# EasyEDA schematic Kyocera breakout board.json
TITLE: Sheet_1; REV: 1.0; Date: 2023-03-23; Sheet: 1/1; Drawn By: carlosvidal; Company: Your Company
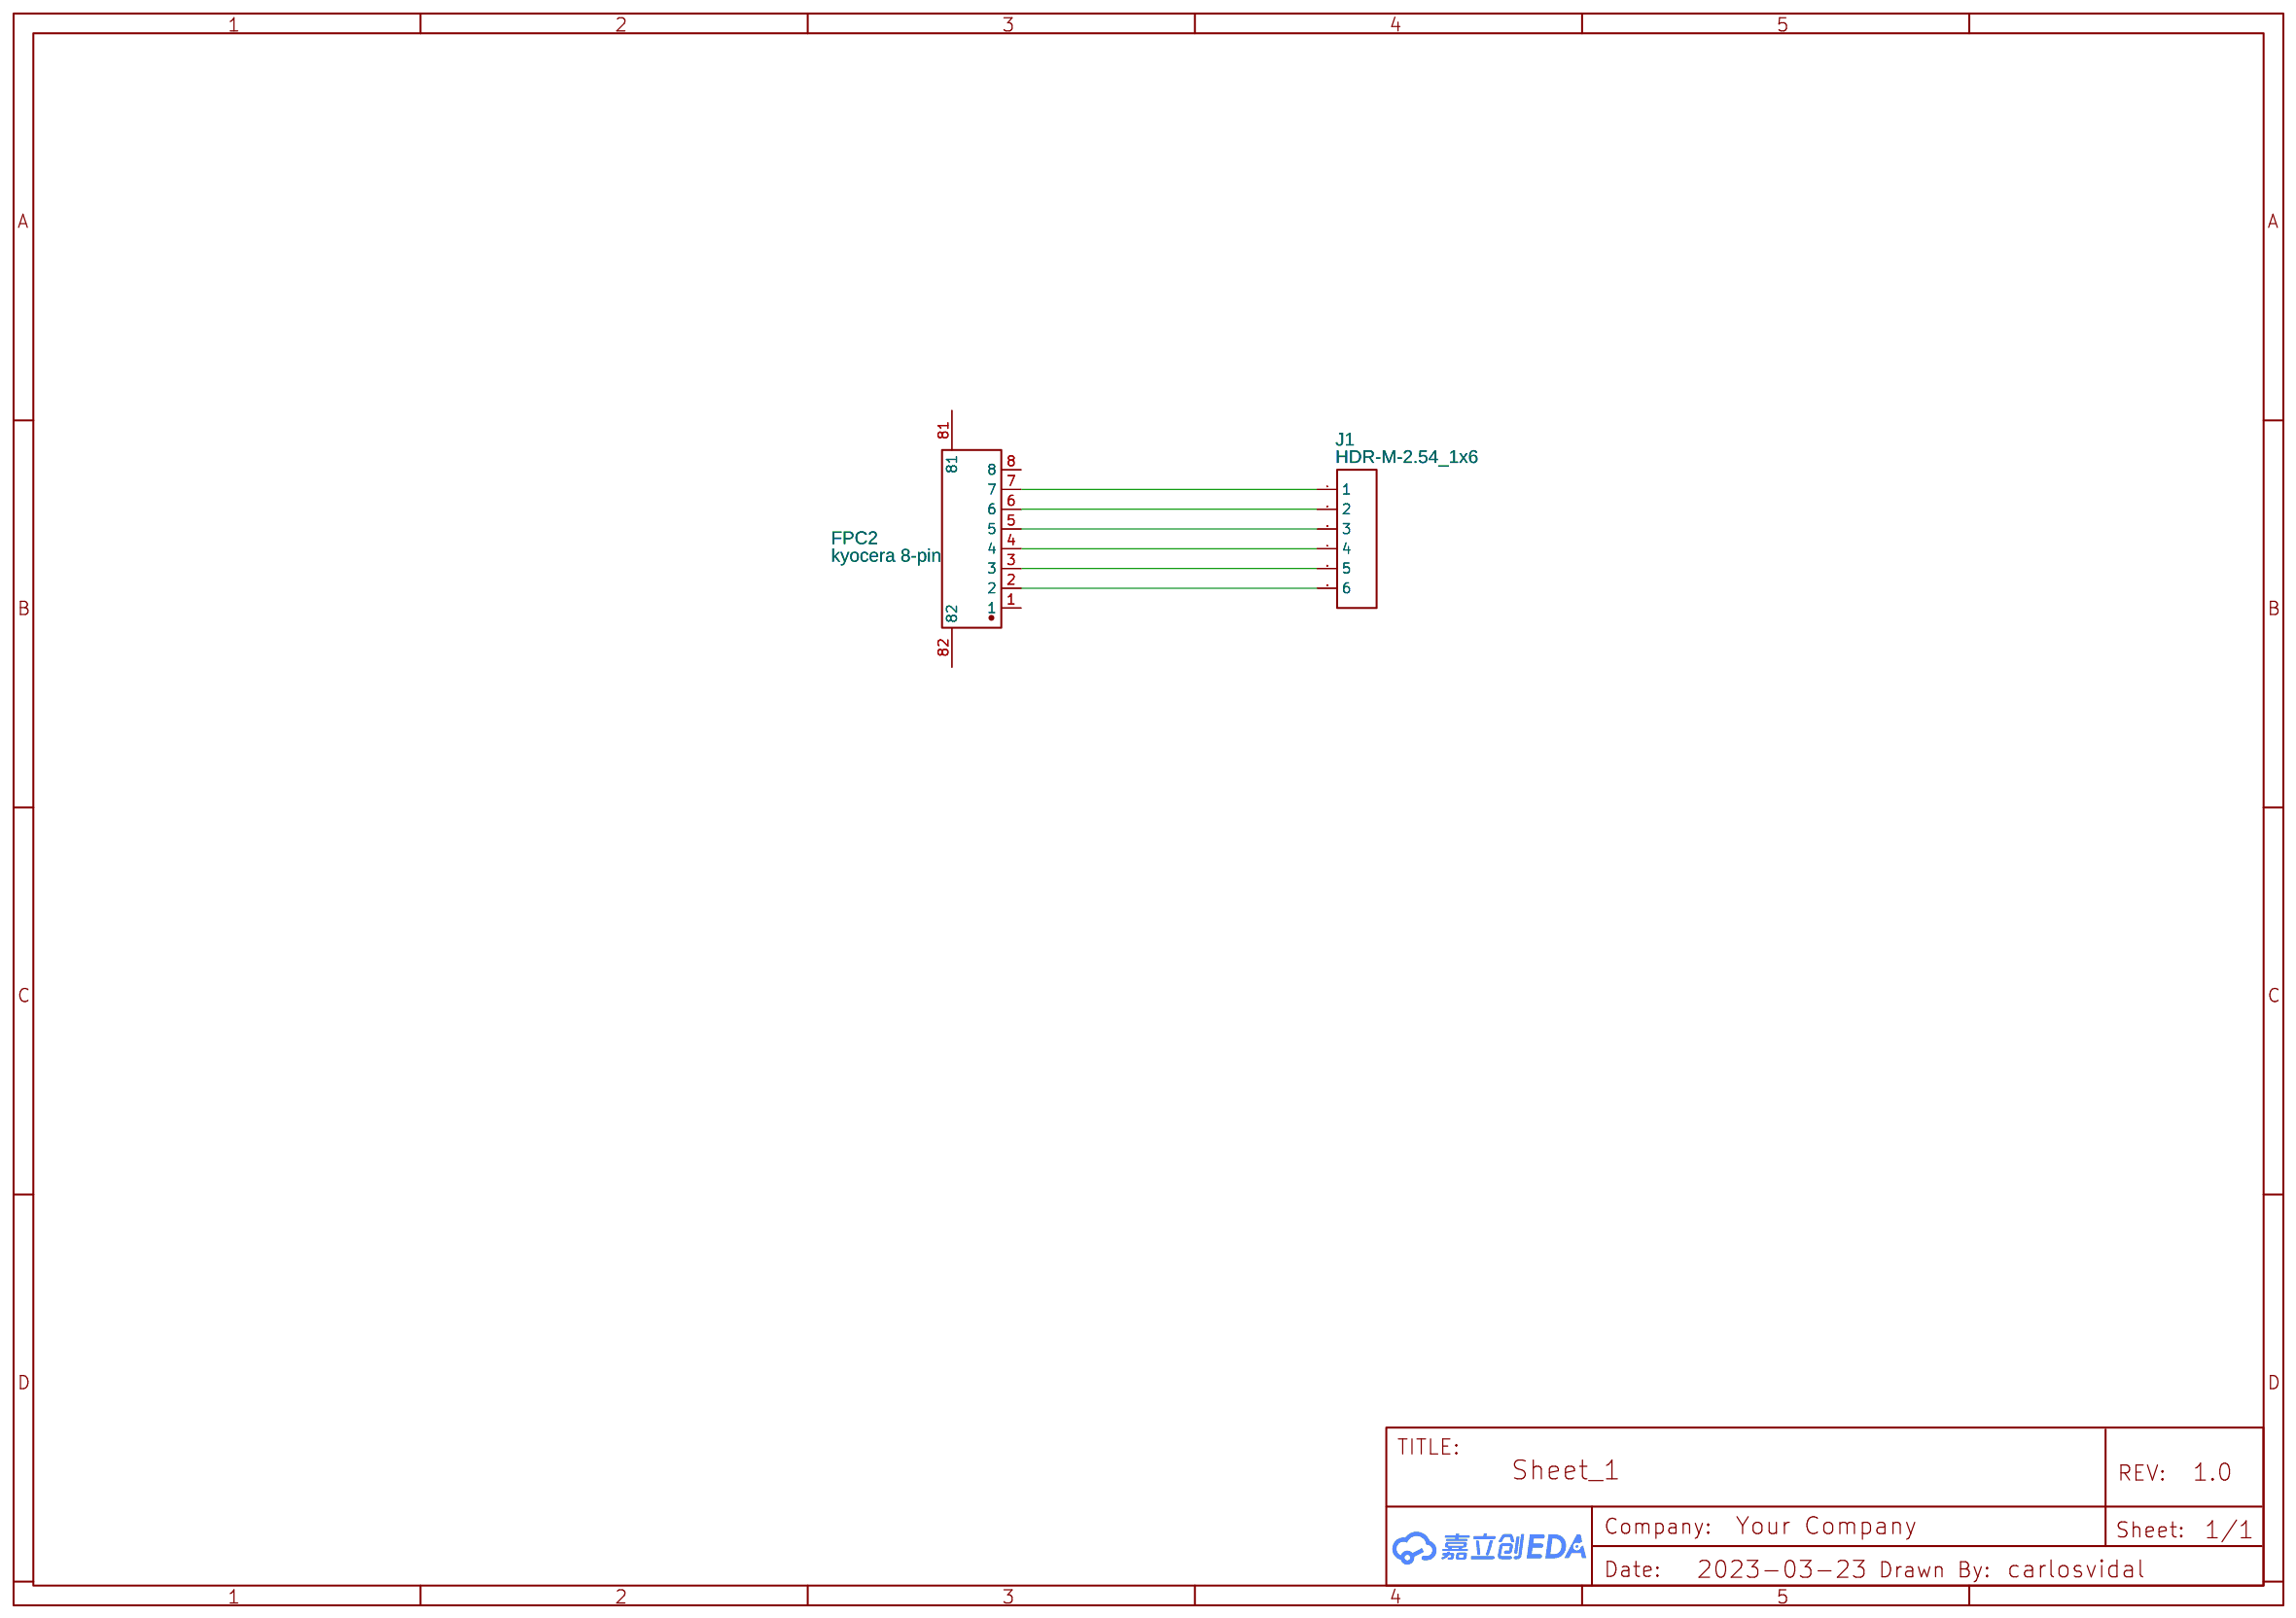
[diagram p0: schematic sheet]

## Parts
FPC2  kyocera 8-pin  [FPC-SMD_046288080000846]
J1  HDR-M-2.54_1x6  [HDR-M-2.54_1X6]

## Library data of the parts
FPC2 = kyocera 8-pin: Supplier: Digi-Key; Supplier Part: C513346; Manufacturer: Kyocera AVX; Manufacturer Part: 046288080000846+; Contributor: carlosvidal; JLCPCB Part Class: Extended Part; link: https://www.digikey.se/en/products/detail/kyocera-avx/046288008000846/2000996
J1 = HDR-M-2.54_1x6: Supplier Part: C190819; Supplier: LCSC; Contributor: LCEDA_Lib

## Nets
Net-(FPC2-2): FPC2.2 J1.6
Net-(FPC2-3): FPC2.3 J1.5
Net-(FPC2-4): FPC2.4 J1.4
Net-(FPC2-5): FPC2.5 J1.3
Net-(FPC2-6): FPC2.6 J1.2
Net-(FPC2-7): FPC2.7 J1.1

Not connected (* = marked no-connect by the designer): FPC2 1 8 81 82
